# EAGLE design valentines-heart-r1 (EAGLE 5.12)
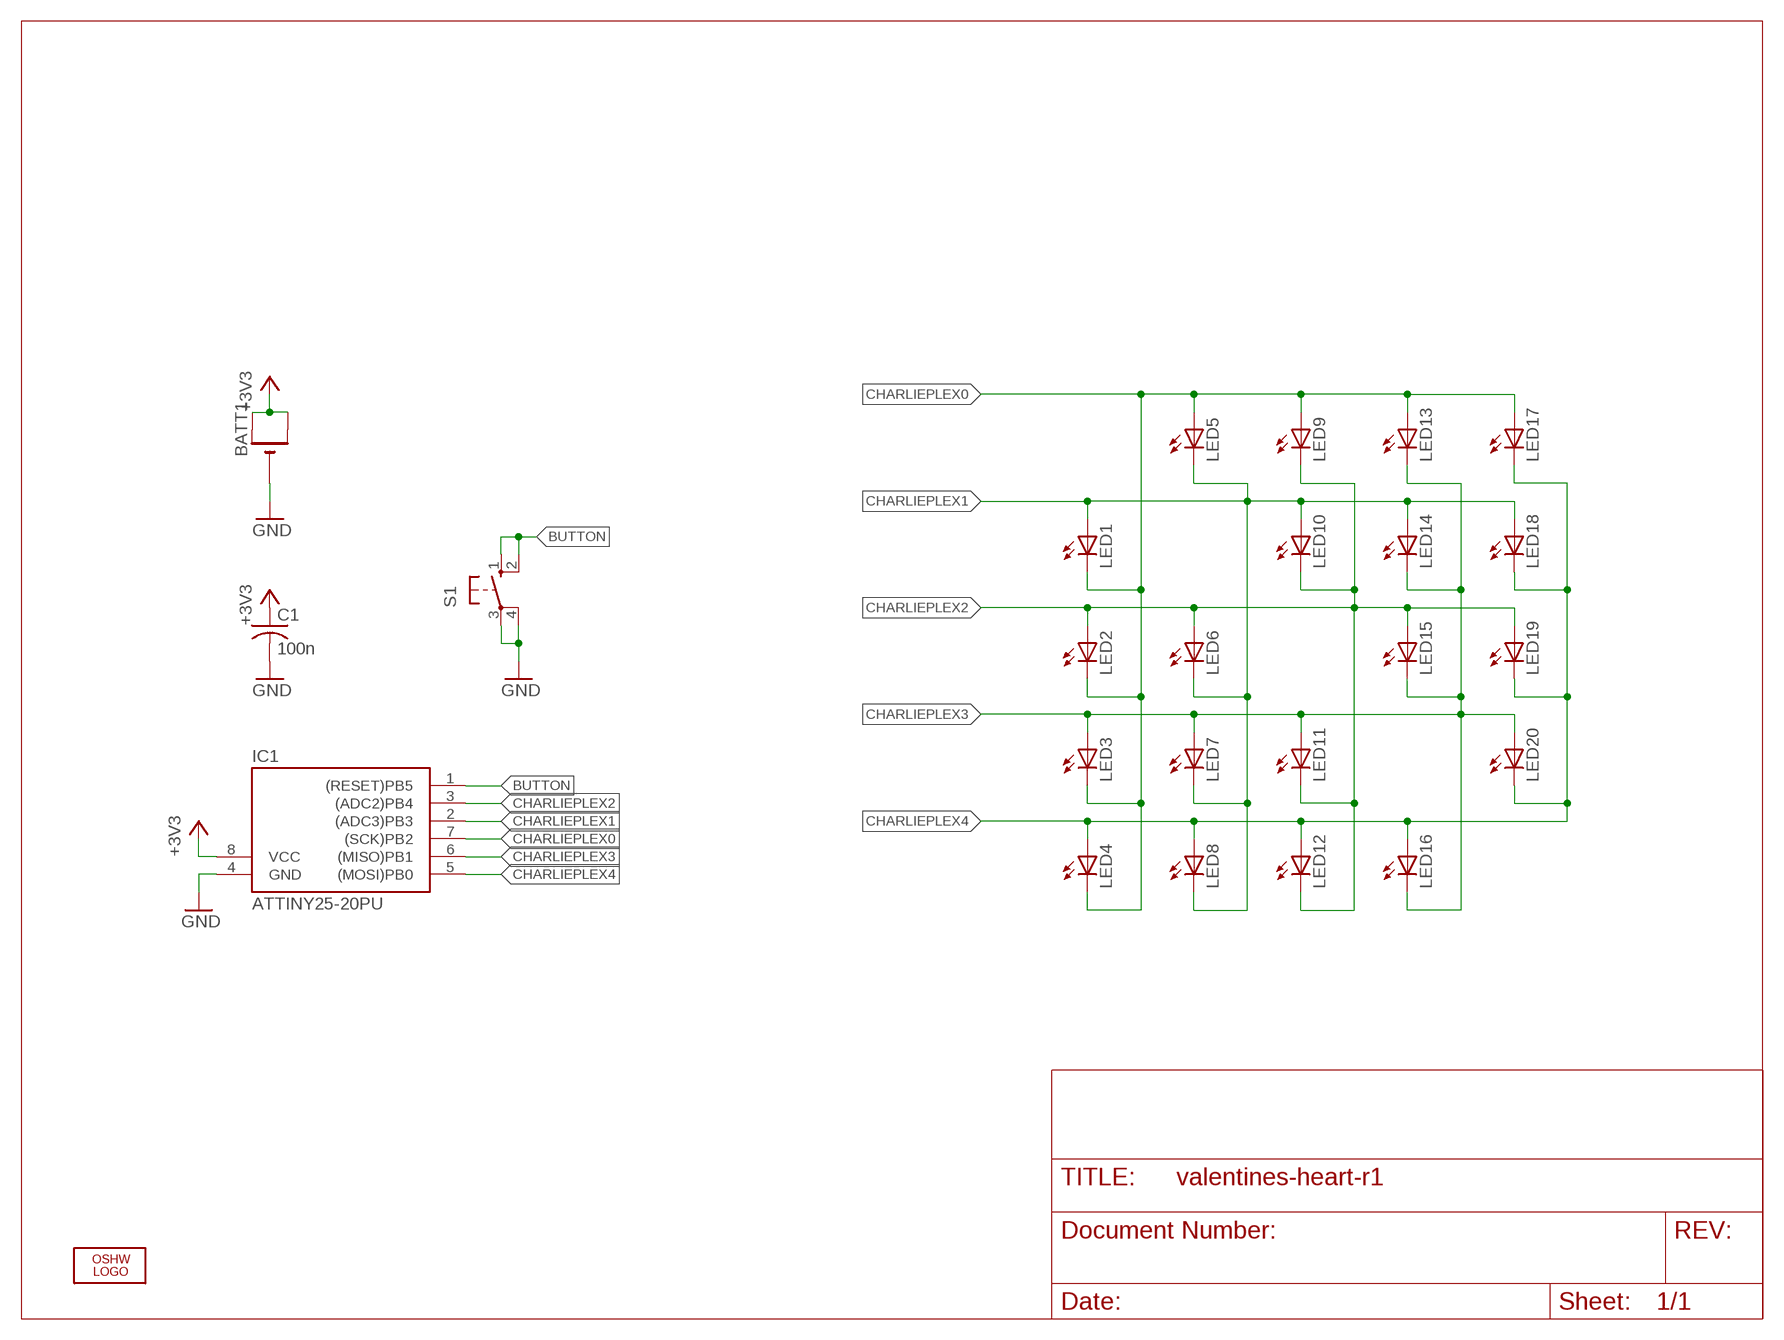
[diagram p0: schematic, sheet 1]

## Parts
BATT1  CR2032THM  [CR2032-THRU]
C1  100n  C-US050-025X075  [C050-025X075]
IC1  ATTINY25-20PU  TINY138P3  [DIL08]
LED1  LED3MM  [LED3MM]
LED2  LED3MM  [LED3MM]
LED3  LED3MM  [LED3MM]
LED4  LED3MM  [LED3MM]
LED5  LED3MM  [LED3MM]
LED6  LED3MM  [LED3MM]
LED7  LED3MM  [LED3MM]
LED8  LED3MM  [LED3MM]
LED9  LED3MM  [LED3MM]
LED10  LED3MM  [LED3MM]
LED11  LED3MM  [LED3MM]
LED12  LED3MM  [LED3MM]
LED13  LED3MM  [LED3MM]
LED14  LED3MM  [LED3MM]
LED15  LED3MM  [LED3MM]
LED16  LED3MM  [LED3MM]
LED17  LED3MM  [LED3MM]
LED18  LED3MM  [LED3MM]
LED19  LED3MM  [LED3MM]
LED20  LED3MM  [LED3MM]
LOGO1  OSHW_LOGO_FILLX0100-NT  [OSHW_FILLX100_NOTEXT]
S1  10-XX  [B3F-10XX]

## Nets
+3V3: BATT1.+1(+) BATT1.+2(+1) C1.1 IC1.8(VCC)
BUTTON: IC1.1((RESET)PB5) S1.1(S) S1.2(S1)
CHARLIEPLEX0: IC1.7((SCK)PB2) LED1.K(C) LED2.K(C) LED3.K(C) LED4.K(C) LED5.A LED9.A LED13.A LED17.A
CHARLIEPLEX1: IC1.2((ADC3)PB3) LED1.A LED5.K(C) LED6.K(C) LED7.K(C) LED8.K(C) LED10.A LED14.A LED18.A
CHARLIEPLEX2: IC1.3((ADC2)PB4) LED2.A LED6.A LED9.K(C) LED10.K(C) LED11.K(C) LED12.K(C) LED15.A LED19.A
CHARLIEPLEX3: IC1.6((MISO)PB1) LED3.A LED7.A LED11.A LED13.K(C) LED14.K(C) LED15.K(C) LED16.K(C) LED20.A
CHARLIEPLEX4: IC1.5((MOSI)PB0) LED4.A LED8.A LED12.A LED16.A LED17.K(C) LED18.K(C) LED19.K(C) LED20.K(C)
GND: BATT1.- C1.2 IC1.4(GND) S1.3(P) S1.4(P1)

## Library data of the parts
BATT1 = adafruit:CR2032
C1 = rcl:C-US: CAPACITOR, American symbol
IC1 = avr-5:TINY13*
LED1-LED20 = led:LED: LED OSRAM: - CHIPLED LG R971, LG N971, LY N971, LG Q971, LY Q971, LO R971, LY R971 LH N974, LH R974 LS Q976, LO Q976, LY Q976 LO Q996 - Hyper CHIPLED LW Q18S LB Q993, LB Q99A, LB R99A - SideLED LS A670, LO A670, LY A670, LG A670, LP A670 LB A673, LV A673, LT A673, LW A673 LH A674 LY A675 LS A676, LA A676, LO A676, LY A676, LW A676 LS A679, LY A679, LG A679 - Hyper Micro SIDELED® LS Y876, LA Y876, LO Y876, LY Y876 LT Y87S - SmartLED LW L88C, LW L88S LB L89C, LB L89S, LG L890 LS L89K, LO L89K, LY L89K LS L896, LA L896, LO L896, LY L896 - TOPLED LS T670, LO T670, LY T670, LG T670, LP T670 LSG T670, LSP T670, LSY T670, LOP T670, LYG T670 LG T671, LOG T671, LSG T671 LB T673, LV T673, LT T673, LW T673 LH T674 LS T676, LA T676, LO T676, LY T676, LB T676, LH T676, LSB T676, LW T676 LB T67C, LV T67C, LT T67C, LS T67K, LO T67K, LY T67K, LW E67C LS E67B, LA E67B, LO E67B, LY E67B, LB E67C, LV E67C, LT E67C LW T67C LS T679, LY T679, LG T679 LS T770, LO T770, LY T770, LG T770, LP T770 LB T773, LV T773, LT T773, LW T773 LH T774 LS E675, LA E675, LY E675, LS T675 LS T776, LA T776, LO T776, LY T776, LB T776 LHGB T686 LT T68C, LB T68C - Hyper Mini TOPLED® LB M676 - Mini TOPLED Santana® LG M470 LS M47K, LO M47K, LY M47K Source: http://www.osram.convergy.de LUXEON: - LUMILED® LXK2-PW12-R00, LXK2-PW12-S00, LXK2-PW14-U00, LXK2-PW14-V00 LXK2-PM12-R00, LXK2-PM12-S00, LXK2-PM14-U00 LXK2-PE12-Q00, LXK2-PE12-R00, LXK2-PE12-S00, LXK2-PE14-T00, LXK2-PE14-U00 LXK2-PB12-K00, LXK2-PB12-L00, LXK2-PB12-M00, LXK2-PB14-N00, LXK2-PB14-P00, LXK2-PB14-Q00 LXK2-PR12-L00, LXK2-PR12-M00, LXK2-PR14-Q00, LXK2-PR14-R00 LXK2-PD12-Q00, LXK2-PD12-R00, LXK2-PD12-S00 LXK2-PH12-R00, LXK2-PH12-S00 LXK2-PL12-P00, LXK2-PL12-Q00, LXK2-PL12-R00 Source: www.luxeon.com KINGBRIGHT: KA-3528ASYC Source: www.kingbright.com
LOGO1 = ohw-logo:OSHW_LOGO_FILL
S1 = rbg-generic-tact-switch:10-XX: OMRON SWITCH

## Board
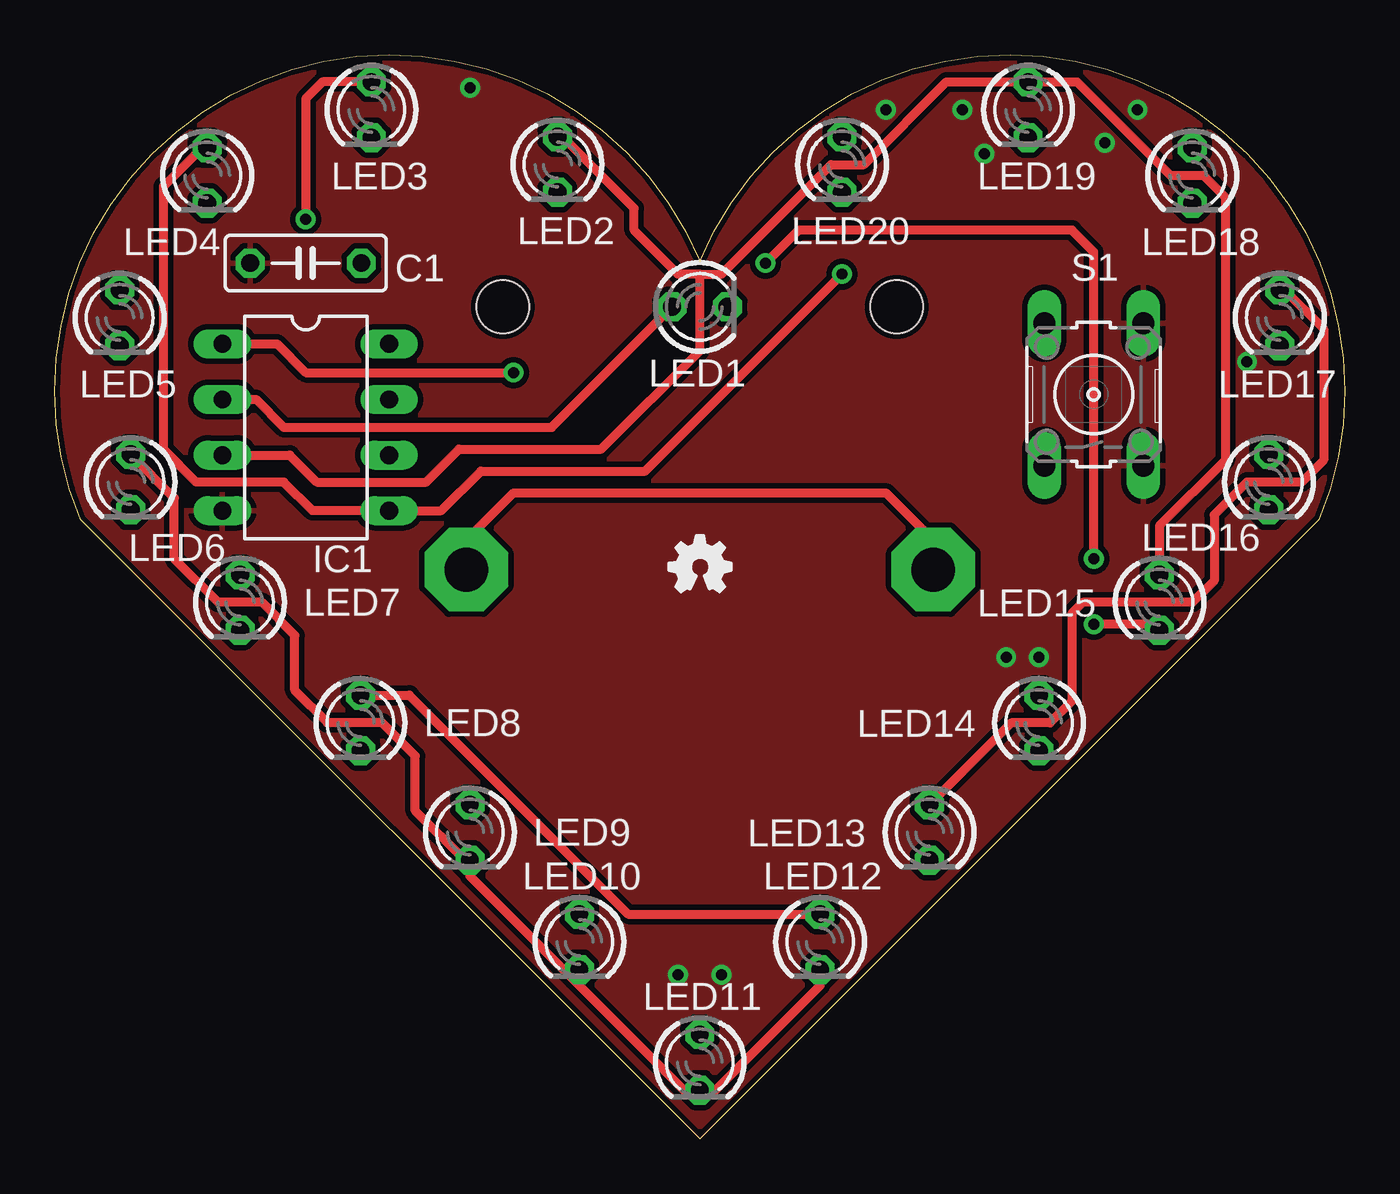
[diagram p1: board, top side]
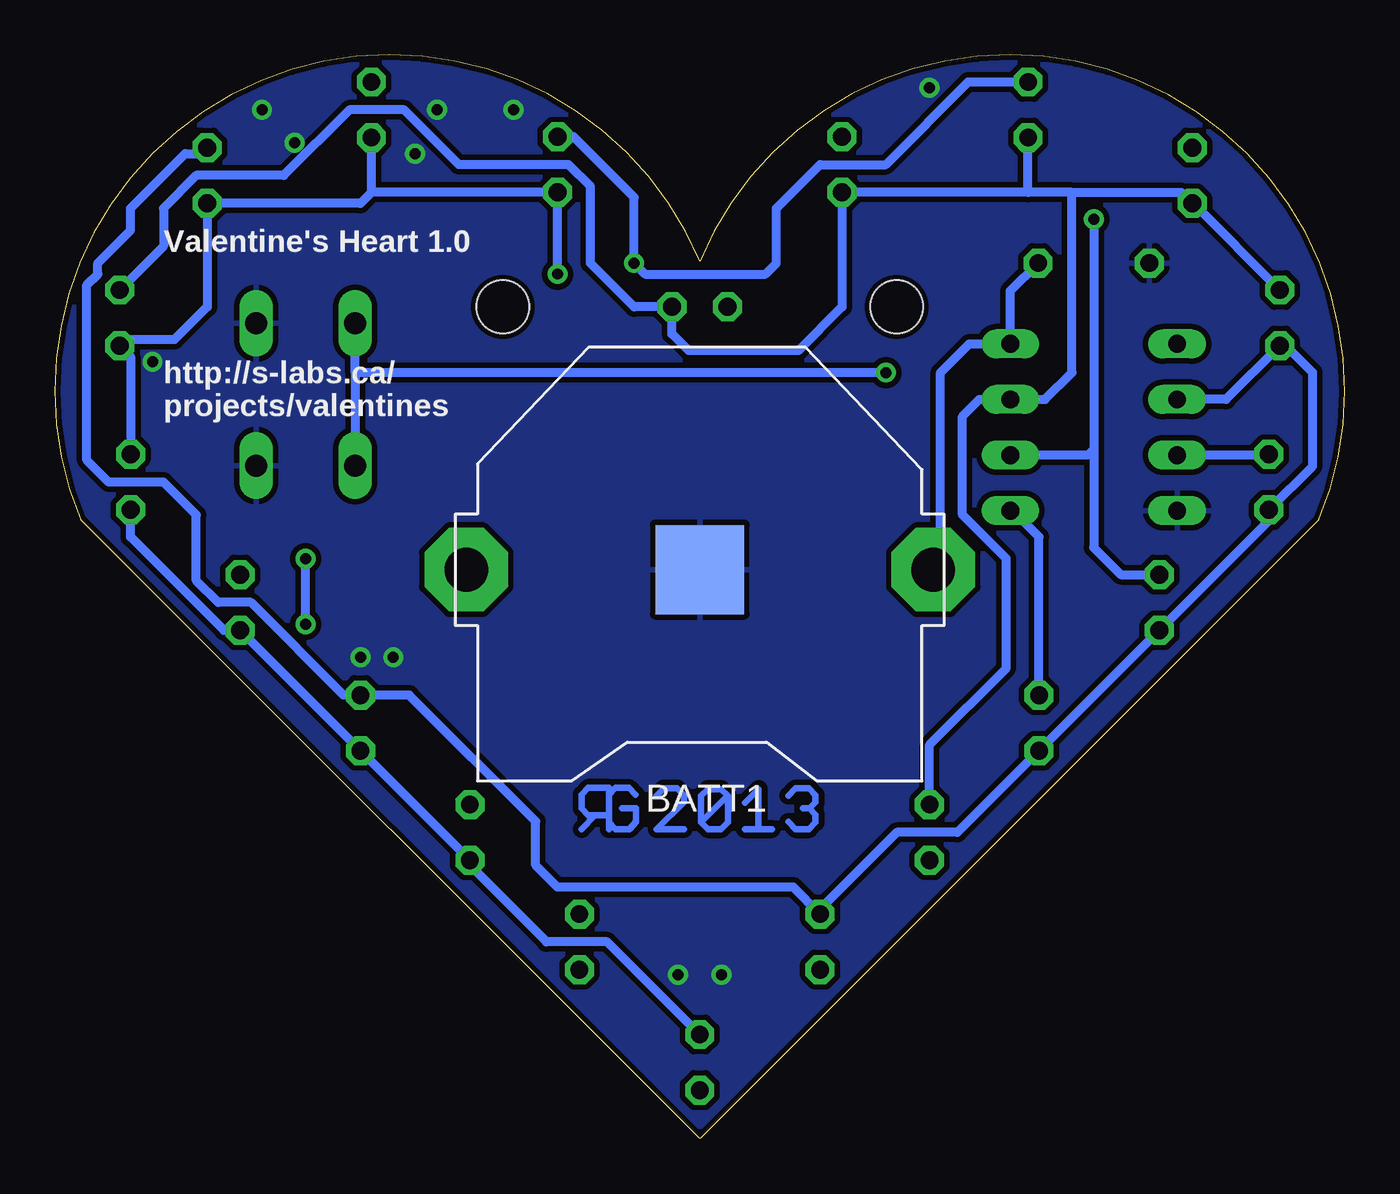
[diagram p2: board, bottom side, seen from below]

Size 58.93 x 49.51 mm. Coordinates in mm from the lower left corner, seen from the top.
Outline: 29.47,0 57.75,28.28 arc180 29.47,40.09 arc180 1.18,28.28 29.47,0
Copper layers (1*16): Top 0.035mm / dielectric 1.5mm / Bottom 0.035mm
Design rules "default *": minimum track width 10mil, minimum drill 0.5mm, track to track 8mil, track to pad 8mil, pad to pad 8mil, via to via 8mil, smd to smd 8mil, copper to edge 10mil, drill to drill 8mil, minimum pad ring 10mil, minimum via ring 8mil, stop-mask expansion 4mil, vias tented up to drill 0mil, thermal gap 10mil
Holes 2.4 mm at 20.47,38 38.47,38

### Footprints (pad centres in the part's own frame; a part is rotated, then mirrored left to right if it is on the bottom)
CR2032-THRU = drill 2 pad 3.81 octagon: +1 -10.668,0; +2 10.668,0 | smd 4.064 x 4.064: - 0,0
C050-025X075 = drill 0.813 octagon: 1 -2.54,0; 2 2.54,0
DIL08 = drill 0.813 long: 1 -3.81,-3.81; 2 -1.27,-3.81; 3 1.27,-3.81; 4 3.81,-3.81; 5 3.81,3.81; 6 1.27,3.81; 7 -1.27,3.81; 8 -3.81,3.81
LED3MM = drill 0.813 octagon: A -1.27,0; K 1.27,0
B3F-10XX = drill 1.016 long: 1 -3.251,2.261; 2 3.251,2.261; 3 -3.251,-2.261; 4 3.251,-2.261

### Placement (x,y rotation side)
BATT1  29.47,26 180 bottom
C1  11.47,40 180 top
IC1  11.47,32.5 270 top
LED1  29.47,38 0 top
LED2  22.97,44.5 270 top
LED3  14.47,47 270 top
LED4  6.97,44 270 top
LED5  2.97,37.5 270 top
LED6  3.47,30 270 top
LED7  8.47,24.5 270 top
LED8  13.97,19 270 top
LED9  18.97,14 270 top
LED10  23.97,9 270 top
LED11  29.47,3.5 270 top
LED12  34.97,9 270 top
LED13  39.97,14 270 top
LED14  44.97,19 270 top
LED15  50.47,24.5 270 top
LED16  55.47,30 270 top
LED17  55.97,37.5 270 top
LED18  51.97,44 270 top
LED19  44.47,47 270 top
LED20  35.97,44.5 270 top
LOGO1  28.07,25 0 top
S1  47.47,34 90 top
U$1  [RGLOGO_SMALL_2013]  33.47,14 0 bottom

### Tracks (layer width: path | path; a pad name or v marks a point on that pad's centre or on a via)
+3V3
  Top 0.406: BATT1.+2 40.14,27.33 37.97,29.5 20.97,29.5 18.8,27.33 BATT1.+1
  Bottom 0.406: C1.1 15.28,38.73 IC1.8 17.16,36.31 18.47,35 18.47,26.33 BATT1.+1
BUTTON  (via drill 0.5)
  Top 0.406: IC1.1 10.16,36.31 11.47,35 v20.97,35
  Bottom 0.406: 45.21,35 S1.1 | 45.21,35 S1.2 | v20.97,35 45.21,35
CHARLIEPLEX0
  Top 0.406: LED17.A 56.2,38.77 57.97,37 57.97,31 56.97,30 54.47,30 52.97,28.5 52.97,25.5 51.97,24.5 46.97,24.5 46.47,24 46.47,20 45.47,19 43.7,19 LED13.A
  Bottom 0.406: 12.47,43.23 7.47,43.23 LED4.K 6.93,42.73 LED5.A | 12.47,43.23 14.47,43.23 | 14.47,43.23 LED2.K 22.97,38 24.97,36 29.97,36 30.74,36.77 LED1.K 32.47,38 34.47,40 34.47,43.5 35.47,44.5 40.47,44.5 42.97,47 45.47,47 48.47,44 52.47,44 53.97,42.5 53.97,40.77 LED17.A | 14.47,43.23 LED3.K | 12.47,43.23 12.47,35 13.7,33.77 IC1.7 16.7,33.77 17.47,33 17.47,28.5 15.47,26.5 15.47,21.5 18.97,18 LED9.A
CHARLIEPLEX1
  Top 0.406: IC1.2 9.2,33.77 10.47,32.5 22.7,32.5 LED1.A
  Bottom 0.406: IC1.2 5.43,33.77 LED5.K 2.7,36.23 1.47,35 1.47,30.73 LED6.K 3.47,28.23 LED7.K LED8.K 17.7,14 20.47,14 23.97,10.5 LED10.A 25.2,11.5 35.97,11.5 36.97,12.5 36.97,14.5 42.74,20.27 LED14.A 45.74,20.27 49.97,24.5 51.47,24.5 52.47,25.5 52.47,28.5 53.97,30 56.47,30 57.47,31 57.47,39 56.97,39.5 56.97,40 55.47,41.5 55.47,42.5 52.97,45 52.24,45 LED18.A
CHARLIEPLEX2
  Top 0.406: LED12.K 34.97,7 30.2,2.23 LED11.K 28.74,2.23 23.72,7.25 | 23.72,7.25 18.97,12 LED9.K 18.74,12.73 16.47,15 16.47,17.5 14.97,19 12.47,19 10.97,20.5 10.97,23 9.47,24.5 7.47,24.5 5.47,26.5 5.47,29.27 LED6.A | LED10.K 23.97,7.5 23.72,7.25 | LED15.A 50.47,28 53.47,31 53.47,43 52.47,44 50.97,44 46.7,48.27 LED19.A 40.74,48.27 36.97,44.5 35.47,44.5 30.47,39.5 29.47,39.5 | LED2.A 23.2,45.77 26.47,42.5 26.47,41.5 28.47,39.5 29.47,39.5 | IC1.3 10.74,31.23 11.97,30 16.97,30 18.47,31.5 24.97,31.5 29.47,36 29.47,39.5
  Bottom 0.406: IC1.3 3.51,31.23 LED6.A
CHARLIEPLEX3  (via drill 0.5)
  Top 0.406: LED3.A 12.24,48.27 11.47,47.5 v11.47,42 | v32.47,40 33.97,41.5 46.47,41.5 47.47,40.5 v47.47,26.5 | v47.47,23.5 50.2,23.5 LED15.K
  Bottom 0.406: LED11.A 33.7,9 36.47,9 39.97,12.5 LED13.K LED14.K LED15.K 51.2,23.23 55.47,27.5 LED16.K | LED7.A 10.24,25.77 11.47,27 11.47,31.5 | v11.47,42 11.47,31.5 | IC1.6 11.74,31.23 11.47,31.5 | LED3.A 17.2,48.27 20.97,44.5 23.97,44.5 25.97,42.5 25.97,40 26.47,39.5 31.97,39.5 v32.47,40 32.47,43 35.24,45.77 LED20.A | v47.47,23.5 v47.47,26.5
CHARLIEPLEX4  (via drill 0.5)
  Top 0.406: LED4.A 6.74,45.27 4.97,43.5 4.97,31.5 6.47,30 10.47,30 11.78,28.69 IC1.5 17.66,28.69 19.47,30.5 26.97,30.5 v35.97,39.5 | LED12.A 26.2,10.27 16.2,20.27 LED8.A
  Bottom 0.406: LED16.A 55.47,35.73 LED17.K 55.7,36.5 53.47,36.5 51.97,38 LED18.K 44.97,42.73 44.47,43.23 | 44.47,43.23 LED20.K v35.97,39.5 | 44.47,43.23 LED19.K | IC1.5 15.28,28.81 13.97,27.5 LED8.A
GND  (via drill 0.5)
  other vias: 47.97,45.5 41.47,47 42.47,45 54.47,35.5 44.97,22 43.47,22 30.47,7.5 28.47,7.5 18.97,48 49.47,47 37.97,47
  pour Bottom (isolate 0.254): -0.53,51 60.47,51 60.47,-4.5 -0.53,-4.5
  pour Top (isolate 0.254): -0.53,51 60.47,51 60.47,-4.5 -0.53,-4.5

### Text on the board
bNames: Valentine's Heart 1.0 | http://s-labs.ca/ | projects/valentines